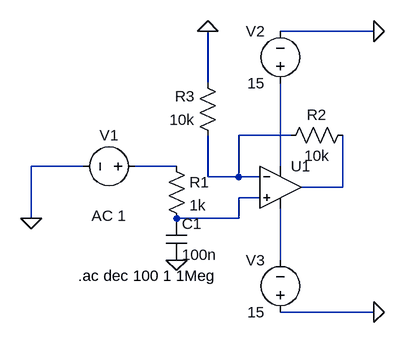
[diagram p0: schematic lowpassfilter.asc]
lowpassfilter.asc, the LTspice schematic file:
Version 4.1
SHEET 1 880 680
WIRE 544 -96 400 -96
WIRE 288 -16 288 -96
WIRE 416 64 336 64
WIRE 96 112 16 112
WIRE 240 112 176 112
WIRE 400 112 400 -16
WIRE 288 128 288 64
WIRE 336 128 336 64
WIRE 336 128 288 128
WIRE 368 128 336 128
WIRE 496 144 496 64
WIRE 496 144 432 144
WIRE 368 160 336 160
WIRE 16 192 16 112
WIRE 336 192 336 160
WIRE 336 192 240 192
WIRE 400 256 400 176
WIRE 544 336 400 336
FLAG 240 256 0
FLAG 16 192 0
FLAG 544 -96 0
FLAG 544 336 0
FLAG 288 -96 0
SYMBOL res 224 96 R0
SYMATTR InstName R1
SYMATTR Value 1k
SYMBOL cap 224 192 R0
SYMATTR InstName C1
SYMATTR Value 100n
SYMBOL voltage 192 112 R90
WINDOW 0 -32 56 VBottom 2
WINDOW 3 32 56 VTop 2
WINDOW 123 60 56 VTop 2
WINDOW 39 0 0 Left 0
SYMATTR InstName V1
SYMATTR Value ""
SYMATTR Value2 AC 1
SYMBOL OpAmps\\UniversalOpAmp 400 144 R0
SYMATTR InstName U1
SYMBOL voltage 400 0 R180
WINDOW 0 24 96 Left 2
WINDOW 3 24 16 Left 2
WINDOW 123 0 0 Left 0
WINDOW 39 0 0 Left 0
SYMATTR InstName V2
SYMATTR Value 15
SYMBOL voltage 400 352 R180
WINDOW 0 24 96 Left 2
WINDOW 3 24 16 Left 2
WINDOW 123 0 0 Left 0
WINDOW 39 0 0 Left 0
SYMATTR InstName V3
SYMATTR Value 15
SYMBOL res 512 48 R90
WINDOW 0 0 56 VBottom 2
WINDOW 3 32 56 VTop 2
SYMATTR InstName R2
SYMATTR Value 10k
SYMBOL res 304 80 R180
WINDOW 0 36 76 Left 2
WINDOW 3 36 40 Left 2
SYMATTR InstName R3
SYMATTR Value 10k
TEXT 88 280 Left 2 !.ac dec 100 1 1Meg

The netlist it stands for:
* lowpassfilter.asc
R1 N002 N005 1k
C1 N005 0 100n
V1 N002 0 AC 1
X§U1 N005 N001 N003 N006 N004 level1 Avol=1Meg GBW=10Meg Vos=0 En=0 Enk=0 In=0 Ink=0 Rin=500Meg  ; pins In+ In- V+ V- OUT
V2 N003 0 15
V3 0 N006 15
R2 N004 N001 10k
R3 N001 0 10k
.ac dec 100 1 1Meg
.lib UniversalOpAmp1.lib
.backanno
.end